# EAGLE schematic Preliminary_PCB_1.3 (EAGLE 9.6.2)
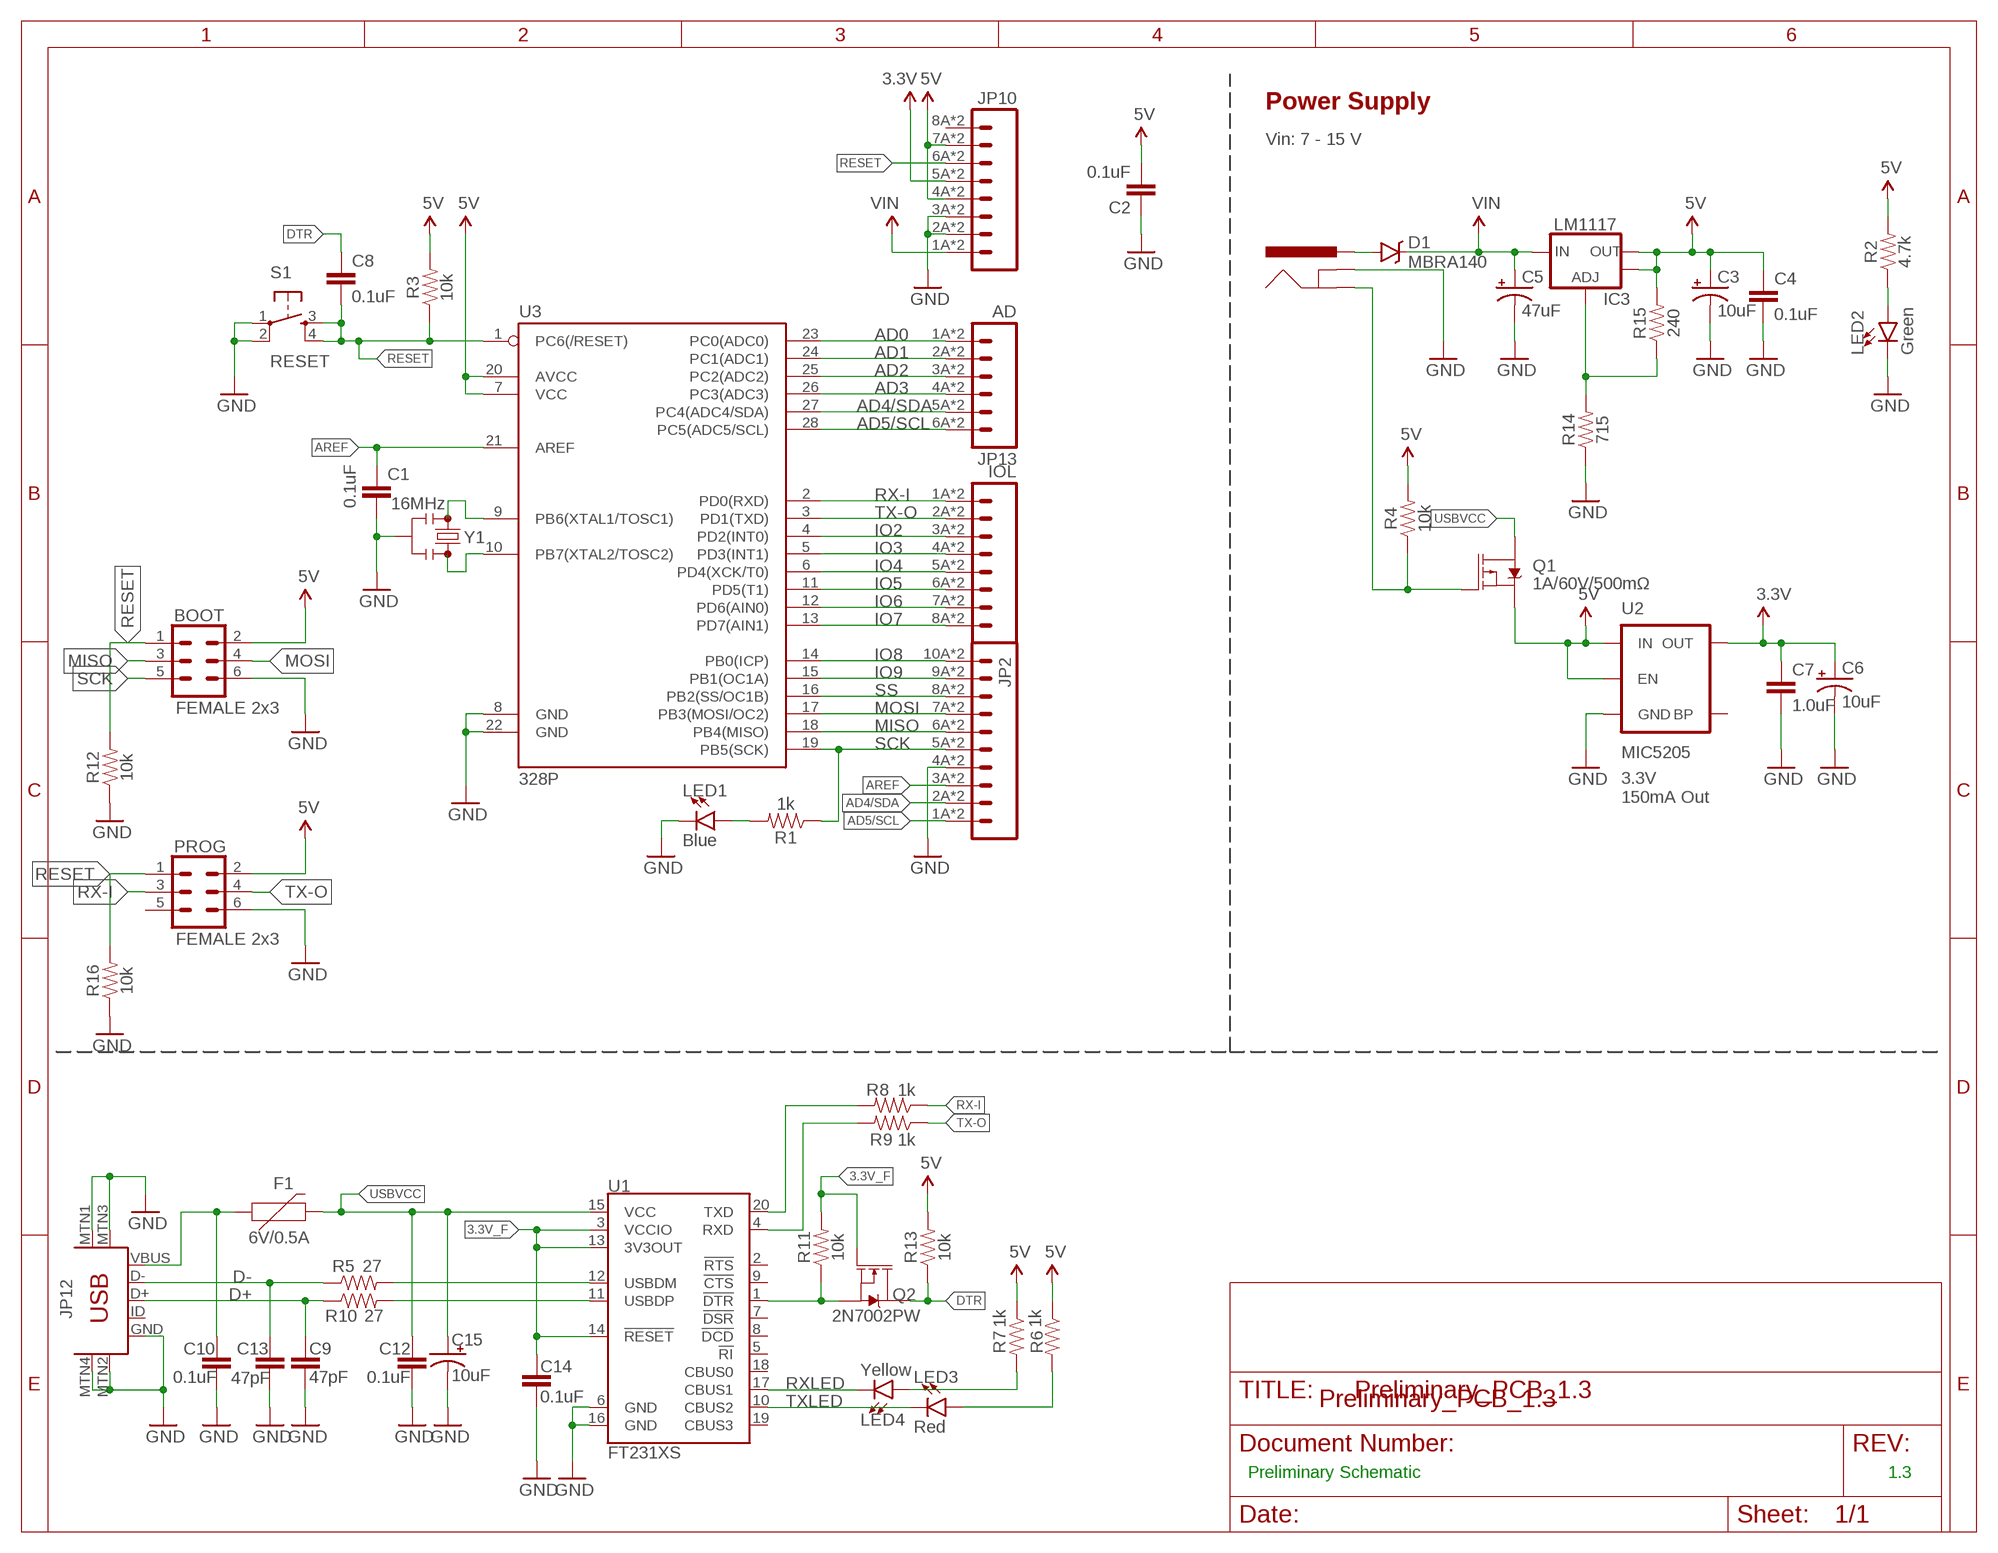
[diagram p0: schematic, sheet 1]

## Parts
BOOT  FEMALE 2x3  CONN_03X2FEMALE  [2X3]
C1  0.1uF  0.1UF-0603-25V-(+80/-20%)  [0603]
C2  0.1uF  0.1UF-0603-25V-(+80/-20%)  [0603]
C3  10uF  10UF-POLAR-EIA3216-16V-10%(TANT)  [EIA3216]
C4  0.1uF  0.1UF-0603-25V-(+80/-20%)  [0603]
C5  47uF  47UF-POLAR-PANASONIC_D-35V-20%  [PANASONIC_D]
C6  10uF  10UF-POLAR-EIA3216-16V-10%(TANT)  [EIA3216]
C7  1.0uF  1.0UF-0603-16V-10%  [0603]
C8  0.1uF  0.1UF-0603-25V-(+80/-20%)  [0603]
C9  47pF  47PF-0603-50V-5%  [0603]
C10  0.1uF  0.1UF-0603-25V-(+80/-20%)  [0603]
C12  0.1uF  0.1UF-0603-25V-(+80/-20%)  [0603]
C13  47pF  47PF-0603-50V-5%  [0603]
C14  0.1uF  0.1UF-0603-25V-(+80/-20%)  [0603]
C15  10uF  10UF-POLAR-EIA3216-16V-10%(TANT)  [EIA3216]
D1  MBRA140  [SMA-DIODE]
F1  6V/0.5A  PTC-HALF_AMP  [1206]
IC3  LM1117  V_REG_LM1117ALT1  [SOT223-ALT1]
J3  POWER_JACKSUPER_BOMB_DIGITY  [POWER_JACK_SMD_OVERPASTE_SUPER_BOMB_DIGITY]
JP2  M10SMD_COMBO  [1X10_SMD_COMBINED]
JP10  M08SMD-COMBO  [1X08_SMD_COMBINED]
JP11  IOL  M08SMD-COMBO  [1X08_SMD_COMBINED]
JP12  USB-MINIB-5PIN  [USB-MINIB]
JP13  AD  M06SMD-STRAIGHT-COMBO  [1X06_SMD_STRAIGHT_COMBO]
LED1  Blue  LED1206  [LED-1206]
LED2  Green  LED1206  [LED-1206]
LED3  Red  LED1206  [LED-1206]
LED4  Yellow  LED1206  [LED-1206]
PROG  FEMALE 2x3  CONN_03X2FEMALE  [2X3]
Q1  1A/60V/500mΩ  MOSFET-PCH-ZXMP6A13F  [SOT23-3]
Q2  2N7002PW  MOSFET-NCH-2N7002PW  [SOT323]
R1  1k  1KOHM-0603-1/10W-1%  [0603]
R2  4.7k  4.7KOHM-0603-1/10W-1%  [0603]
R3  10k  10KOHM-0603-1/10W-1%  [0603]
R4  10k  10KOHM-0603-1/10W-1%  [0603]
R5  27  27OHM-0603-1/10W-1%  [0603]
R6  1k  1KOHM-0603-1/10W-1%  [0603]
R7  1k  1KOHM-0603-1/10W-1%  [0603]
R8  1k  1KOHM-0603-1/10W-1%  [0603]
R9  1k  1KOHM-0603-1/10W-1%  [0603]
R10  27  27OHM-0603-1/10W-1%  [0603]
R11  10k  10KOHM-0603-1/10W-1%  [0603]
R12  10k  10KOHM-0603-1/10W-1%  [0603]
R13  10k  10KOHM-0603-1/10W-1%  [0603]
R14  715  715OHM-0603-1/10W-1%  [0603]
R15  240  240OHM-0603-1/10W-1%  [0603]
R16  10k  10KOHM-0603-1/10W-1%  [0603]
S1  RESET  SWITCH_SPST_4_PINSQUARE  [TACTILE-SWITCH-SMD]
U1  FT231XS  [SSOP20_L]
U2  MIC5205  MIC52053.3V  [SOT23-5]
U3  328P  ATMEGA328P_PDIP  [DIP28]
Y1  16MHz  RESONATOR-16MHZSMD_3.2X1.3  [RESONATOR-SMD-3.2X1.3]

## Nets
3.3V: C6.+ C7.1 JP10.5A JP10.5B U2.5(OUT)
3.3V_F: C14.1 Q2.1(G) R11.2 U1.3(VCCIO) U1.13(3V3OUT) U1.14(!RESET)
5V: BOOT.2 C2.2 C3.+ C4.1 IC3.2(OUT) IC3.4(OUT) JP10.4A JP10.4B JP10.7A JP10.7B PROG.2 Q1.2(S) R2.2 R3.2 R4.2 R6.1 R7.1 R13.2 R15.2 U2.1(IN) U2.3(EN) U3.7(VCC) U3.20(AVCC)
AD0: JP13.1A JP13.1B U3.23(PC0(ADC0))
AD1: JP13.2A JP13.2B U3.24(PC1(ADC1))
AD2: JP13.3A JP13.3B U3.25(PC2(ADC2))
AD3: JP13.4A JP13.4B U3.26(PC3(ADC3))
AD4/SDA: JP2.2A JP2.2B JP13.5A JP13.5B U3.27(PC4(ADC4/SDA))
AD5/SCL: JP2.1A JP2.1B JP13.6A JP13.6B U3.28(PC5(ADC5/SCL))
AREF: C1.1 JP2.3A JP2.3B U3.21(AREF)
D+: C9.1 JP12.D+ R10.1
D-: C13.1 JP12.D- R5.1
DTR: C8.1 Q2.3(D) R13.1
FTDI_DTR: Q2.2(S) R11.1 U1.1(!DTR)
GND: BOOT.6 C1.2 C2.1 C3.- C4.2 C5.- C6.- C7.2 C9.2 C10.2 C12.2 C13.2 C14.2 C15.- J3.GND(GNDBREAK) JP2.4A JP2.4B JP10.2A JP10.2B JP10.3A JP10.3B JP12.GND JP12.MTN1(MTN2) JP12.MTN2(MTN3) JP12.MTN3(MTN1) JP12.MTN4 LED1.C LED2.C PROG.6 R12.1 R14.1 R16.1 S1.1 S1.2 U1.6(GND) U1.16(GND) U2.2(GND) U3.8(GND) U3.22(GND) Y1.2
INSERT: J3.P$4(GND) Q1.1(G) R4.1
IO2: JP11.3A JP11.3B U3.4(PD2(INT0))
IO3: JP11.4A JP11.4B U3.5(PD3(INT1))
IO4: JP11.5A JP11.5B U3.6(PD4(XCK/T0))
IO5: JP11.6A JP11.6B U3.11(PD5(T1))
IO6: JP11.7A JP11.7B U3.12(PD6(AIN0))
IO7: JP11.8A JP11.8B U3.13(PD7(AIN1))
IO8: JP2.10A JP2.10B U3.14(PB0(ICP))
IO9: JP2.9A JP2.9B U3.15(PB1(OC1A))
MISO: BOOT.3 JP2.6A JP2.6B U3.18(PB4(MISO))
MOSI: BOOT.4 JP2.7A JP2.7B U3.17(PB3(MOSI/OC2))
N$1: LED1.A R1.2
N$2: LED2.A R2.1
N$3: U3.9(PB6(XTAL1/TOSC1)) Y1.1
N$4: U3.10(PB7(XTAL2/TOSC2)) Y1.3
N$6: R5.2 U1.12(USBDM)
N$7: R10.2 U1.11(USBDP)
N$8: LED3.A R6.2
N$10: LED4.A R7.2
N$15: IC3.1(ADJ) R14.2 R15.1
PWRIN: D1.A J3.VIN0(PWR)
RESET: BOOT.1 C8.2 JP10.6A JP10.6B PROG.1 R3.1 R12.2 R16.2 S1.3 S1.4 U3.1(PC6(/RESET))
RX-I: JP11.1A JP11.1B PROG.3 R8.1 U3.2(PD0(RXD))
RXD: R9.2 U1.4(RXD)
RXLED: LED4.C U1.17(CBUS1)
SCK: BOOT.5 JP2.5A JP2.5B R1.1 U3.19(PB5(SCK))
SS: JP2.8A JP2.8B U3.16(PB2(SS/OC1B))
TX-O: JP11.2A JP11.2B PROG.4 R9.1 U3.3(PD1(TXD))
TXD: R8.2 U1.20(TXD)
TXLED: LED3.C U1.10(CBUS2)
USBVCC: C12.1 C15.+ F1.2 Q1.3(D) U1.15(VCC)
VIN: C5.+ D1.C IC3.3(IN) JP10.1A JP10.1B
VUSB: C10.1 F1.1 JP12.VBUS
Unconnected: JP10.8A JP10.8B JP12.ID PROG.5 U1.2(!RTS) U1.5(!RI) U1.7(!DSR) U1.8(!DCD) U1.9(!CTS) U1.18(CBUS0) U1.19(CBUS3) U2.4(BP)

## Notes on the sheet
- Power Supply
- Vin: 7 - 15 V
- 3.3V
  150mA Out
- Preliminary_PCB_1.3
- Preliminary Schematic | 1.3

## Library data of the parts
BOOT PROG = SparkFun-Connectors:CONN_03X2: Multi connection point. Often used as Generic Header-pin footprint for 0.1 inch spaced/style header connections You can populate with any combo of single row headers, but if you'd like an exact match, check these: Header - 2x3 (Male, 0.1") <https://www.sparkfun.com/products/12807> (PRT-12807) Header - 2x3 (Female, 0.1") <https://www.sparkfun.com/products/13010> (PRT-13010) 2x3 Pin Shrouded Header <https://www.sparkfun.com/products/10877> (PRT-10877) On any of the 0.1 inch spaced packages, you can populate with these: Break Away Headers - Straight <https://www.sparkfun.com/products/116> (PRT-00116) Break Away Male Headers - Right Angle <https://www.sparkfun.com/products/553> (PRT-00553) Female Headers <https://www.sparkfun.com/products/115> (PRT-00115) Break Away Headers - Machine Pin <https://www.sparkfun.com/products/117> (PRT-00117) Break Away Female Headers - Swiss Machine Pin <https://www.sparkfun.com/products/743> (PRT-00743) Special note: the shrouded connector mates well with our 3x2 ribbon cables: Ribbon Crimp Connector - 6-pin (2x3, Female) <https://www.sparkfun.com/products/10651> (PRT-10651) Ribbon Cable - 6 wire (15ft) <https://www.sparkfun.com/products/10646> (PRT-10646); PROD_ID: CONN-11566
C1 C2 C4 C8 C10 C12 C14 = SparkFun-Capacitors:0.1UF: 0.1µF ceramic capacitors A capacitor is a passive two-terminal electrical component used to store electrical energy temporarily in an electric field.; PROD_ID: CAP-00810
C3 C6 C15 = SparkFun-Capacitors:10UF-POLAR: 10.0µF polarized capacitors A capacitor is a passive two-terminal electrical component used to store electrical energy temporarily in an electric field.; PROD_ID: CAP-00811
C5 = SparkFun-Capacitors:47UF-POLAR: 47µF polarized capacitors A capacitor is a passive two-terminal electrical component used to store electrical energy temporarily in an electric field.; PROD_ID: CAP-08478
C7 = SparkFun-Capacitors:1.0UF: 1µF ceramic capacitors A capacitor is a passive two-terminal electrical component used to store electrical energy temporarily in an electric field.; PROD_ID: CAP-00868
C9 C13 = SparkFun-Capacitors:47PF: 47pF ceramic capacitors A capacitor is a passive two-terminal electrical component used to store electrical energy temporarily in an electric field.; PROD_ID: CAP-08913
D1 = SparkFun-DiscreteSemi:MBRA140: 40V, 1A Schottky rectifier SMA/DO-214AC package DIO-08053; PROD_ID: DIO-08053
F1 = SparkFun-Fuses:PTC: Resettable Fuse PTC Resettable Fuse. Really a resistor with a postive temperature coefficient who's resistance increases dramatically with an increase in temperature. When heated by the power passing through the resistance rises causing the current to be limited, protecting the circuit. When a PTC cools back down it resumes conducting letting the circuit turn back on.; PROD_ID: RES-08585
IC3 = Testing:V_REG_LM1117: Voltage Regulator LM1117 Standard adjustable voltage regulator but in SMD form. Spark Fun Electronics SKU : COM-00595; PROD_ID: VREG-08170
J3 = Testing:POWER_JACK: Power Jack This is the standard 5.5mm barrel jack for power. The PTH is the most common, proven, reliable, footprint. All others are experimental. The Slot footprint only works if the mill layer is transmitted to the PCB fab house so be warned. Spark Fun Electronics SKU : PRT-00119. Mating wall wart : TOL-00298 (and others); PROD_ID: CONN-08106
JP2 = SparkFun-Connectors:M10: Header 10 Standard 10-pin 0.1" header. Use with straight break away headers (SKU : PRT-00116), right angle break away headers (PRT-00553), swiss pins (PRT-00743), machine pins (PRT-00117), and female headers (PRT-00115).; PROD_ID: CONN-11219
JP10 JP11 = SparkFun-Connectors:M08: Header 8 Standard 8-pin 0.1" header. Use with straight break away headers (SKU : PRT-00116), right angle break away headers (PRT-00553), swiss pins (PRT-00743), machine pins (PRT-00117), and female headers (PRT-00115).; PROD_ID: CONN-10204
JP12 = SparkFun-Connectors:USB-MINIB: Mini-USB "B" connector with 5th pin broken out. Created new symbol breaking out 5th "ID" pin in mini/micro USB connector spec. See: http://en.wikipedia.org/wiki/Mini_usb#Cables. Uses same footprint as 4-pin symbol. Also added pins to connect to mounting / shield pads if required (probably not generally needed as signals aren't shielded once they leave the connector).; PROD_ID: CONN-08193
JP13 = SparkFun-Connectors:M06: Header 6 Standard 6-pin 0.1" header. Use with straight break away headers (SKU : PRT-00116), right angle break away headers (PRT-00553), swiss pins (PRT-00743), machine pins (PRT-00117), and female headers (PRT-00115). Molex polarized connector foot print use with SKU : PRT-08094 with associated crimp pins and housings. NOTES ON THE VARIANTS LOCK and LOCK_LONGPADS... This footprint was designed to help hold the alignment of a through-hole component (i.e. 6-pin header) while soldering it into place. You may notice that each hole has been shifted either up or down by 0.005 of an inch from it's more standard position (which is a perfectly straight line). This slight alteration caused the pins (the squares in the middle) to touch the edges of the holes. Because they are alternating, it causes a "brace" to hold the component in place. 0.005 has proven to be the perfect amount of "off-center" position when using our standard breakaway headers. Although looks a little odd when you look at the bare footprint, once you have a header in there, the alteration is very hard to notice. Also,if you push a header all the way into place, it is covered up entirely on the bottom side. This idea of altering the position of holes to aid alignment will be further integrated into the Sparkfun Library for other footprints. It can help hold any component with 3 or more connection pins.; PROD_ID: CONN-10203
LED1 = SparkFun-LED:LED: LED (Generic) Standard schematic elements and footprints for 5mm, 3mm, 1206, and 0603 sized LEDs. Generic LEDs with no color specified.; PROD_ID: DIO-09911
LED2 = SparkFun-LED:LED: LED (Generic) Standard schematic elements and footprints for 5mm, 3mm, 1206, and 0603 sized LEDs. Generic LEDs with no color specified.; PROD_ID: DIO-09910
LED3 = SparkFun-LED:LED: LED (Generic) Standard schematic elements and footprints for 5mm, 3mm, 1206, and 0603 sized LEDs. Generic LEDs with no color specified.; PROD_ID: DIO-09912
LED4 = SparkFun-LED:LED: LED (Generic) Standard schematic elements and footprints for 5mm, 3mm, 1206, and 0603 sized LEDs. Generic LEDs with no color specified.; PROD_ID: DIO-09909
Q1 = SparkFun-DiscreteSemi:MOSFET-PCH: P-channel MOSFETs Voltage controlled devices that allow control of high current outputs.; PROD_ID: TRANS-08285
Q2 = SparkFun-DiscreteSemi:MOSFET-NCH: N-channel MOSFETs Voltage controlled devices that allow control of high current outputs.; PROD_ID: TRANS-11151; VALUE: 310mA/60V/1.6Ω
R1 R6-R9 = SparkFun-Resistors:1KOHM: 1kΩ resistor A resistor is a passive two-terminal electrical component that implements electrical resistance as a circuit element. Resistors act to reduce current flow, and, at the same time, act to lower voltage levels within circuits.; PROD_ID: RES-07856
R2 = SparkFun-Resistors:4.7KOHM: 4.7kΩ resistor A resistor is a passive two-terminal electrical component that implements electrical resistance as a circuit element. Resistors act to reduce current flow, and, at the same time, act to lower voltage levels within circuits.; PROD_ID: RES-07857
R3 R4 R11-R13 R16 = SparkFun-Resistors:10KOHM: 10kΩ resistor A resistor is a passive two-terminal electrical component that implements electrical resistance as a circuit element. Resistors act to reduce current flow, and, at the same time, act to lower voltage levels within circuits.; PROD_ID: RES-00824
R5 R10 = SparkFun-Resistors:27OHM: 27Ω resistor A resistor is a passive two-terminal electrical component that implements electrical resistance as a circuit element. Resistors act to reduce current flow, and, at the same time, act to lower voltage levels within circuits.; PROD_ID: RES-09334
R14 = SparkFun-Resistors:715OHM: 715Ω resistor A resistor is a passive two-terminal electrical component that implements electrical resistance as a circuit element. Resistors act to reduce current flow, and, at the same time, act to lower voltage levels within circuits.; PROD_ID: RES-07850
R15 = SparkFun-Resistors:240OHM: 240Ω resistor A resistor is a passive two-terminal electrical component that implements electrical resistance as a circuit element. Resistors act to reduce current flow, and, at the same time, act to lower voltage levels within circuits.; PROD_ID: RES-07849
S1 = SparkFun-Electromechanical:SWITCH_SPST_4_PIN; PROD_ID: SWCH-08247
U1 = SparkFun-IC-Comms:FT231X: FTDI FT231X Full Speed USB to Full-handshake UART This USB2.0 Full Speed IC offers a compact bridge to full handshake UART interfaces. The device is a UART, capable of operating up to 3MBaud, with low power consumption (8mA). The FT231X includes the complete FT-X series feature set and enables USB to be added into a system design quickly and easily over a UART interface.; PROD_ID: IC-11524
U2 = SparkFun-PowerIC:MIC5205: MIC5205 150mA vreg 3.3V - VREG-00822 5V - VREG-00823; PROD_ID: VREG-00822
U3 = SparkFun-IC-Microcontroller:ATMEGA328P_PDIP: Atmel 328P Through hole ATMEGA328P uC used in the Arduino 32kb flash, 1k EEPROM, 2k SRAM Datasheet <http://www.sparkfun.com/datasheets/Components/SMD/ATMega328.pdf> SparkFun Products Storefront component: AVR 28 Pin 20MHz 32K 6A/D - ATMega328P <https://www.sparkfun.com/products/9061> (COM-09061) SparkFun Simon Says - Through-Hole Soldering Kit <https://www.sparkfun.com/products/10547> (KIT-10547) SparkFun Learn to Solder - Simon Says <https://www.sparkfun.com/products/13708> (KIT-13708) SparkFun BigTime Watch Kit <https://www.sparkfun.com/products/11734> (KIT-11734) SparkFun ClockIt <https://www.sparkfun.com/products/10930> (KIT-10930) SparkFun Serial Enabled LCD Kit <https://www.sparkfun.com/products/10097> (LCD-10097) SparkFun Simon Tilts - Through Hole Soldering Kit <https://www.sparkfun.com/products/12634> (KIT-12634) SparkFun Frequency Counter Kit <https://www.sparkfun.com/products/10140> (KIT-10140) FabFM Radio Kit <https://www.sparkfun.com/products/11043> (KIT-11043) SparkFun Binary Blaster Kit <https://www.sparkfun.com/products/12037> (KIT-12037) SparkFun Metro-Gnome <https://www.sparkfun.com/products/9236> (KIT-09236) ATmega328 with Arduino Optiboot (Uno) <https://www.sparkfun.com/products/10524> (DEV-10524); PROD_ID: IC-09136
Y1 = SparkFun-Clocks:RESONATOR-16MHZ: 16MHz Resonator Digikey Example <http://www.digikey.com/product-detail/en/murata-electronics-north-america/CSTCE16M0V53-R0/490-1198-1-ND/584635> Frequency: 16MHz Frequency Stability: ±0.3% Frequency Tolerance: ±0.5% Capacitance: 15pF; PROD_ID: XTAL-08900

## Net classes
0 default: width 0.152 mm, drill 0.305 mm, clearance 0.152 mm